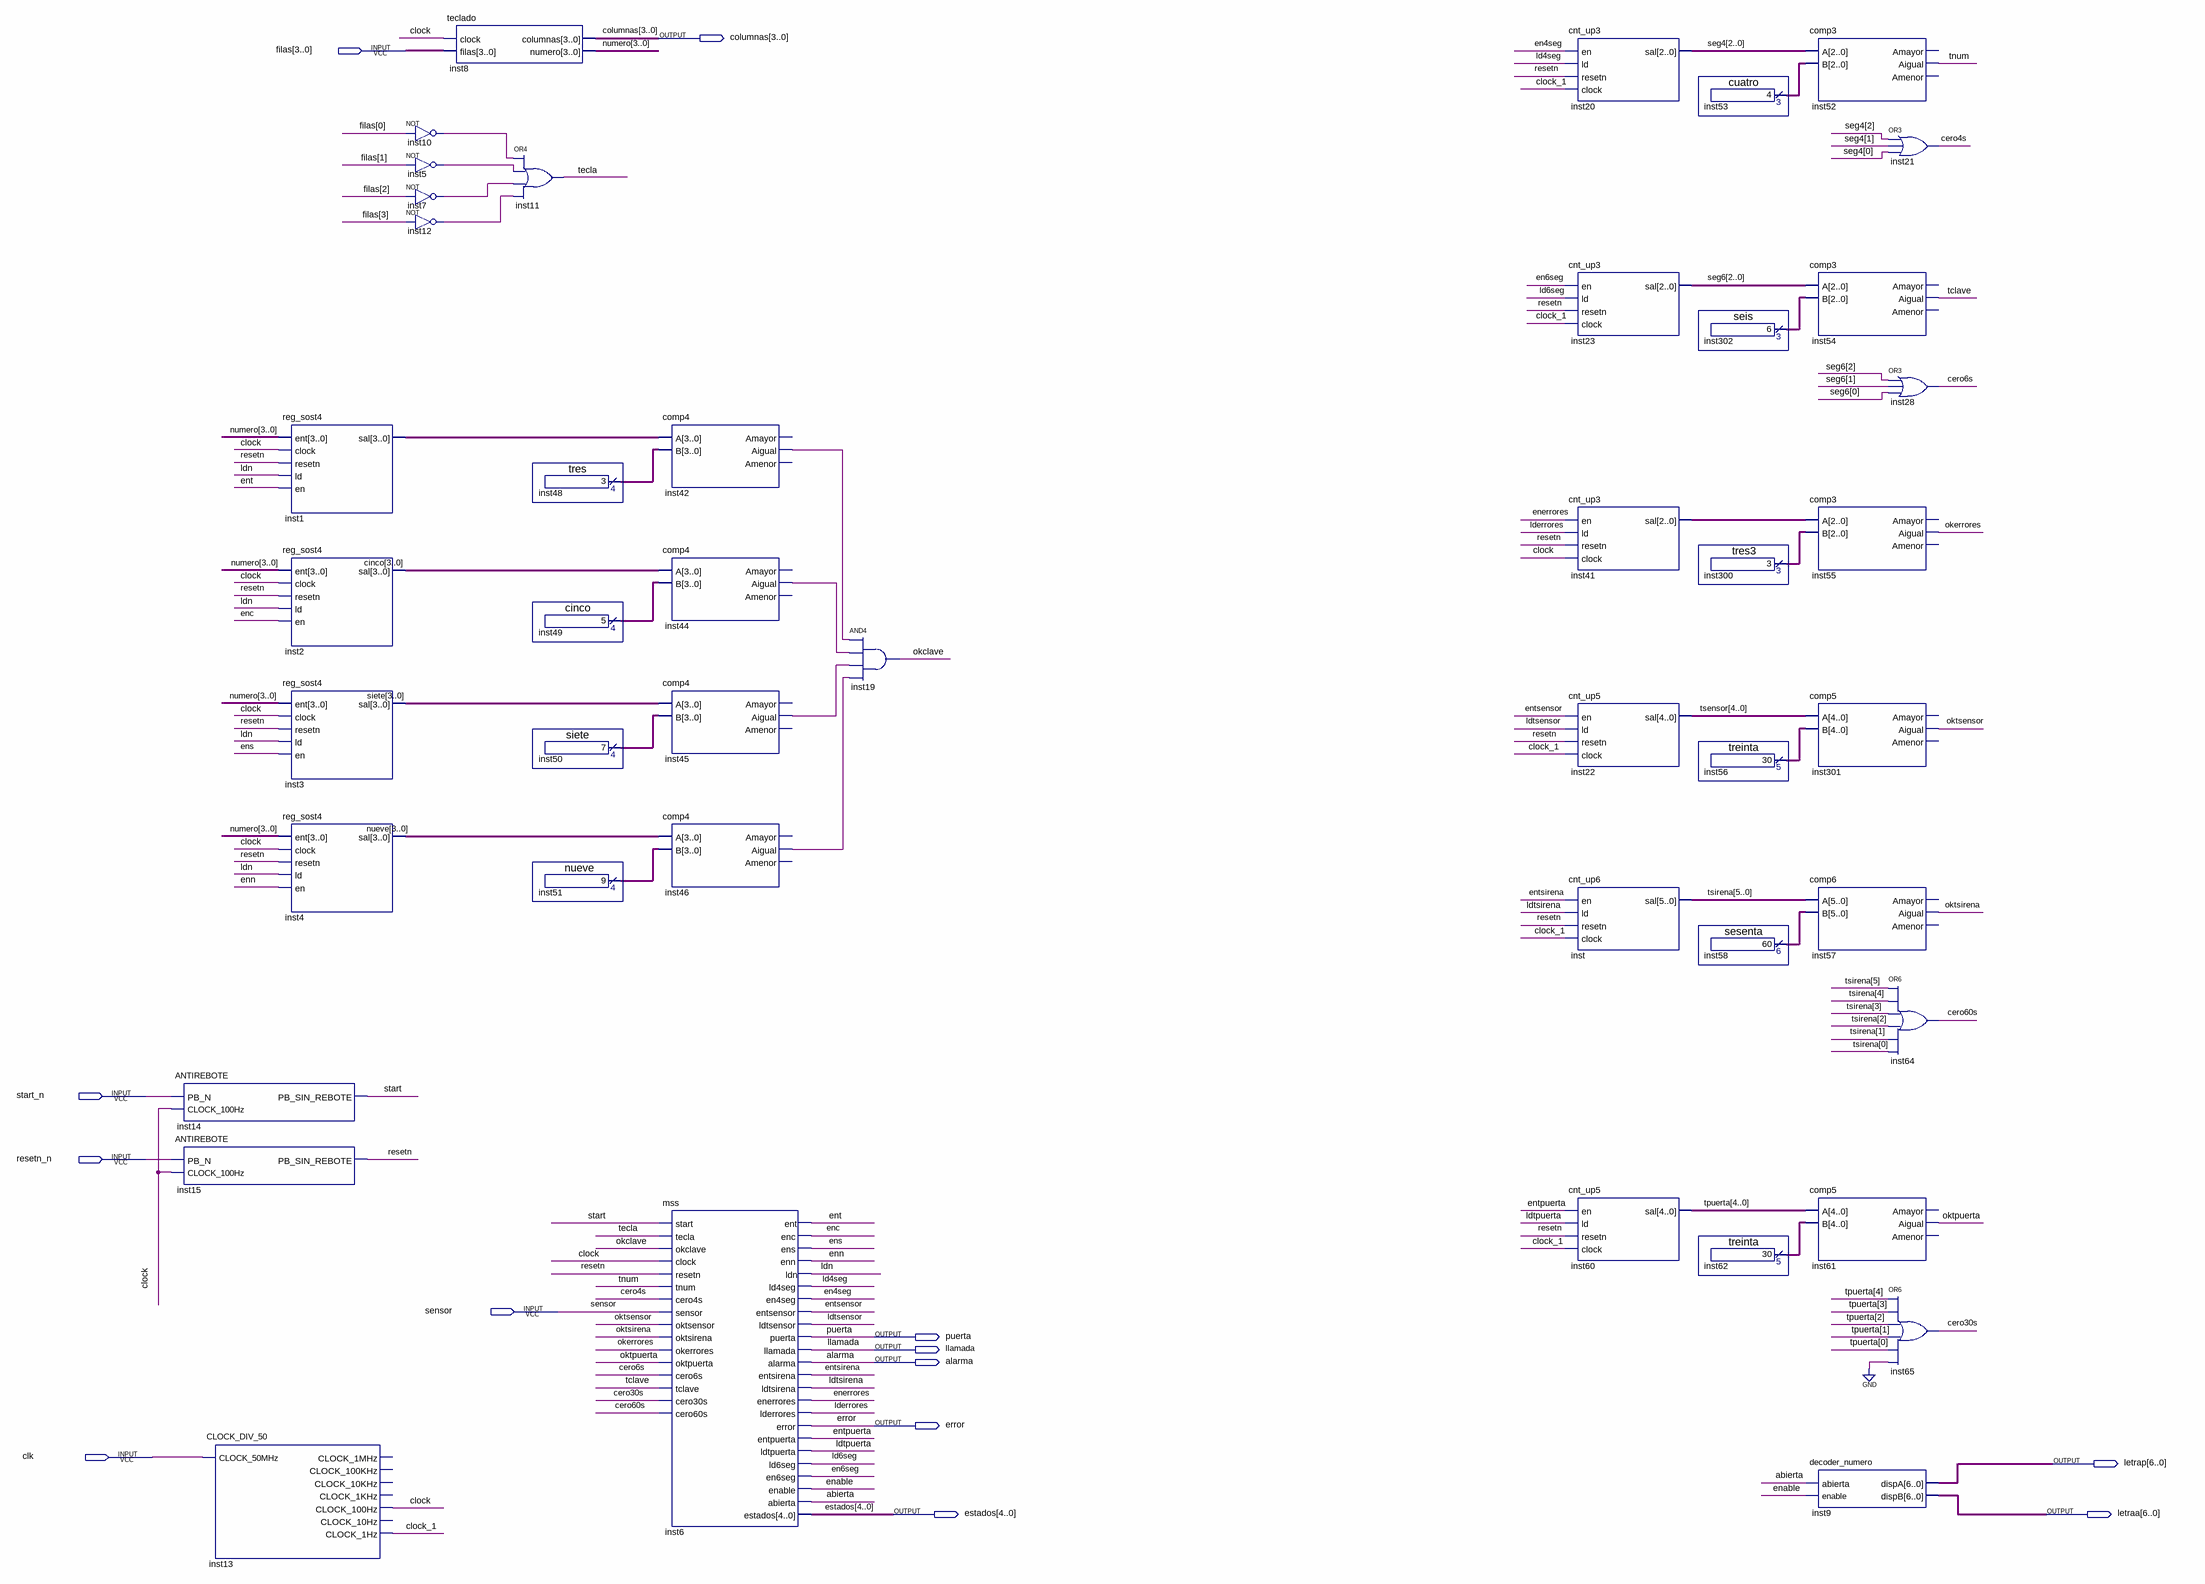
[diagram p0: schematic sheet]
// Quartus schematic particion.bdf as structural Verilog: 46 symbols, 13 pins
module particion (
  input  [3:0] filas,
  input  start_n,
  input  resetn_n,
  input  sensor,
  input  clk,
  output [3:0] columnas,
  output puerta,
  output llamada,
  output alarma,
  output error,
  output [6:0] letrap,
  output [4:0] estados,
  output [6:0] letraa
);

  wire abierta, cero4s, cero6s, cero30s, cero60s, clock, clock_1, en4seg, en6seg, enable, enc, enerrores,
       enn, ens, ent, entpuerta, entsensor, entsirena, inst5_out, inst7_out, inst10_out, inst12_out,
       inst42_aigual, inst44_aigual, inst45_aigual, inst46_aigual, ld4seg, ld6seg, lderrores, ldn, ldtpuerta,
       ldtsensor, ldtsirena, okclave, okerrores, oktpuerta, oktsensor, oktsirena, resetn, start, tclave,
       tecla, tnum;
  wire [2:0] inst41_sal, inst53_result, inst300_result, inst302_result, seg4, seg6;
  wire [3:0] cinco, inst1_sal, inst48_result, inst49_result, inst50_result, inst51_result, nueve, numero,
       siete;
  wire [4:0] inst56_result, inst62_result, tpuerta, tsensor;
  wire [5:0] inst58_result, tsirena;

  ANTIREBOTE inst14 (.PB_N(start_n), .CLOCK_100Hz(clock), .PB_SIN_REBOTE(start));
  ANTIREBOTE inst15 (.PB_N(resetn_n), .CLOCK_100Hz(clock), .PB_SIN_REBOTE(resetn));
  CLOCK_DIV_50 inst13 (
    .CLOCK_50MHz(clk), .CLOCK_100Hz(clock), .CLOCK_1Hz(clock_1));  // open: CLOCK_1MHz, CLOCK_100KHz, CLOCK_10KHz, CLOCK_1KHz, CLOCK_10Hz
  reg_sost4 inst1 (.ent(numero), .clock(clock), .resetn(resetn), .ld(ldn), .en(ent), .sal(inst1_sal));
  reg_sost4 inst2 (.ent(numero), .clock(clock), .resetn(resetn), .ld(ldn), .en(enc), .sal(cinco));
  reg_sost4 inst3 (.ent(numero), .clock(clock), .resetn(resetn), .ld(ldn), .en(ens), .sal(siete));
  reg_sost4 inst4 (.ent(numero), .clock(clock), .resetn(resetn), .ld(ldn), .en(enn), .sal(nueve));
  not inst10 (inst10_out, filas[0]);
  not inst5 (inst5_out, filas[1]);
  not inst7 (inst7_out, filas[2]);
  not inst12 (inst12_out, filas[3]);
  teclado inst8 (.clock(clock), .filas(filas), .columnas(columnas), .numero(numero));
  or inst11 (tecla, inst10_out, inst5_out, inst7_out, inst12_out);
  tres inst48 (.result(inst48_result));
  cinco inst49 (.result(inst49_result));
  siete inst50 (.result(inst50_result));
  nueve inst51 (.result(inst51_result));
  comp4 inst42 (.A(inst1_sal), .B(inst48_result), .Aigual(inst42_aigual));  // open: Amayor, Amenor
  comp4 inst44 (.A(cinco), .B(inst49_result), .Aigual(inst44_aigual));  // open: Amayor, Amenor
  comp4 inst45 (.A(siete), .B(inst50_result), .Aigual(inst45_aigual));  // open: Amayor, Amenor
  comp4 inst46 (.A(nueve), .B(inst51_result), .Aigual(inst46_aigual));  // open: Amayor, Amenor
  mss inst6 (
    .start(start), .tecla(tecla), .okclave(okclave), .clock(clock), .resetn(resetn), .tnum(tnum),
    .cero4s(cero4s), .sensor(sensor), .oktsensor(oktsensor), .oktsirena(oktsirena), .okerrores(okerrores),
    .oktpuerta(oktpuerta), .cero6s(cero6s), .tclave(tclave), .cero30s(cero30s), .cero60s(cero60s), .ent(ent),
    .enc(enc), .ens(ens), .enn(enn), .ldn(ldn), .ld4seg(ld4seg), .en4seg(en4seg), .entsensor(entsensor),
    .ldtsensor(ldtsensor), .puerta(puerta), .llamada(llamada), .alarma(alarma), .entsirena(entsirena),
    .ldtsirena(ldtsirena), .enerrores(enerrores), .lderrores(lderrores), .error(error),
    .entpuerta(entpuerta), .ldtpuerta(ldtpuerta), .ld6seg(ld6seg), .en6seg(en6seg), .enable(enable),
    .abierta(abierta), .estados(estados));
  and inst19 (okclave, inst42_aigual, inst44_aigual, inst45_aigual, inst46_aigual);
  cnt_up3 inst20 (.en(en4seg), .ld(ld4seg), .resetn(resetn), .clock(clock_1), .sal(seg4));
  cnt_up3 inst23 (.en(en6seg), .ld(ld6seg), .resetn(resetn), .clock(clock_1), .sal(seg6));
  cnt_up3 inst41 (.en(enerrores), .ld(lderrores), .resetn(resetn), .clock(clock), .sal(inst41_sal));
  cnt_up5 inst22 (.en(entsensor), .ld(ldtsensor), .resetn(resetn), .clock(clock_1), .sal(tsensor));
  cnt_up6 inst (.en(entsirena), .ld(ldtsirena), .resetn(resetn), .clock(clock_1), .sal(tsirena));
  cnt_up5 inst60 (.en(entpuerta), .ld(ldtpuerta), .resetn(resetn), .clock(clock_1), .sal(tpuerta));
  cuatro inst53 (.result(inst53_result));
  seis inst302 (.result(inst302_result));
  tres3 inst300 (.result(inst300_result));
  treinta inst56 (.result(inst56_result));
  sesenta inst58 (.result(inst58_result));
  treinta inst62 (.result(inst62_result));
  comp3 inst52 (.A(seg4), .B(inst53_result), .Aigual(tnum));  // open: Amayor, Amenor
  comp3 inst54 (.A(seg6), .B(inst302_result), .Aigual(tclave));  // open: Amayor, Amenor
  comp3 inst55 (.A(inst41_sal), .B(inst300_result), .Aigual(okerrores));  // open: Amayor, Amenor
  comp5 inst301 (.A(tsensor), .B(inst56_result), .Aigual(oktsensor));  // open: Amayor, Amenor
  comp6 inst57 (.A(tsirena), .B(inst58_result), .Aigual(oktsirena));  // open: Amayor, Amenor
  comp5 inst61 (.A(tpuerta), .B(inst62_result), .Aigual(oktpuerta));  // open: Amayor, Amenor
  decoder_numero inst9 (.abierta(abierta), .enable(enable), .dispA(letrap), .dispB(letraa));
  or inst21 (cero4s, seg4[2], seg4[1], seg4[0]);
  or inst28 (cero6s, seg6[2], seg6[1], seg6[0]);
  or inst64 (cero60s, tsirena[5], tsirena[4], tsirena[3], tsirena[2], tsirena[1], tsirena[0]);
  or inst65 (cero30s, tpuerta[4], tpuerta[3], tpuerta[2], tpuerta[1], tpuerta[0], 1'b0);
endmodule
